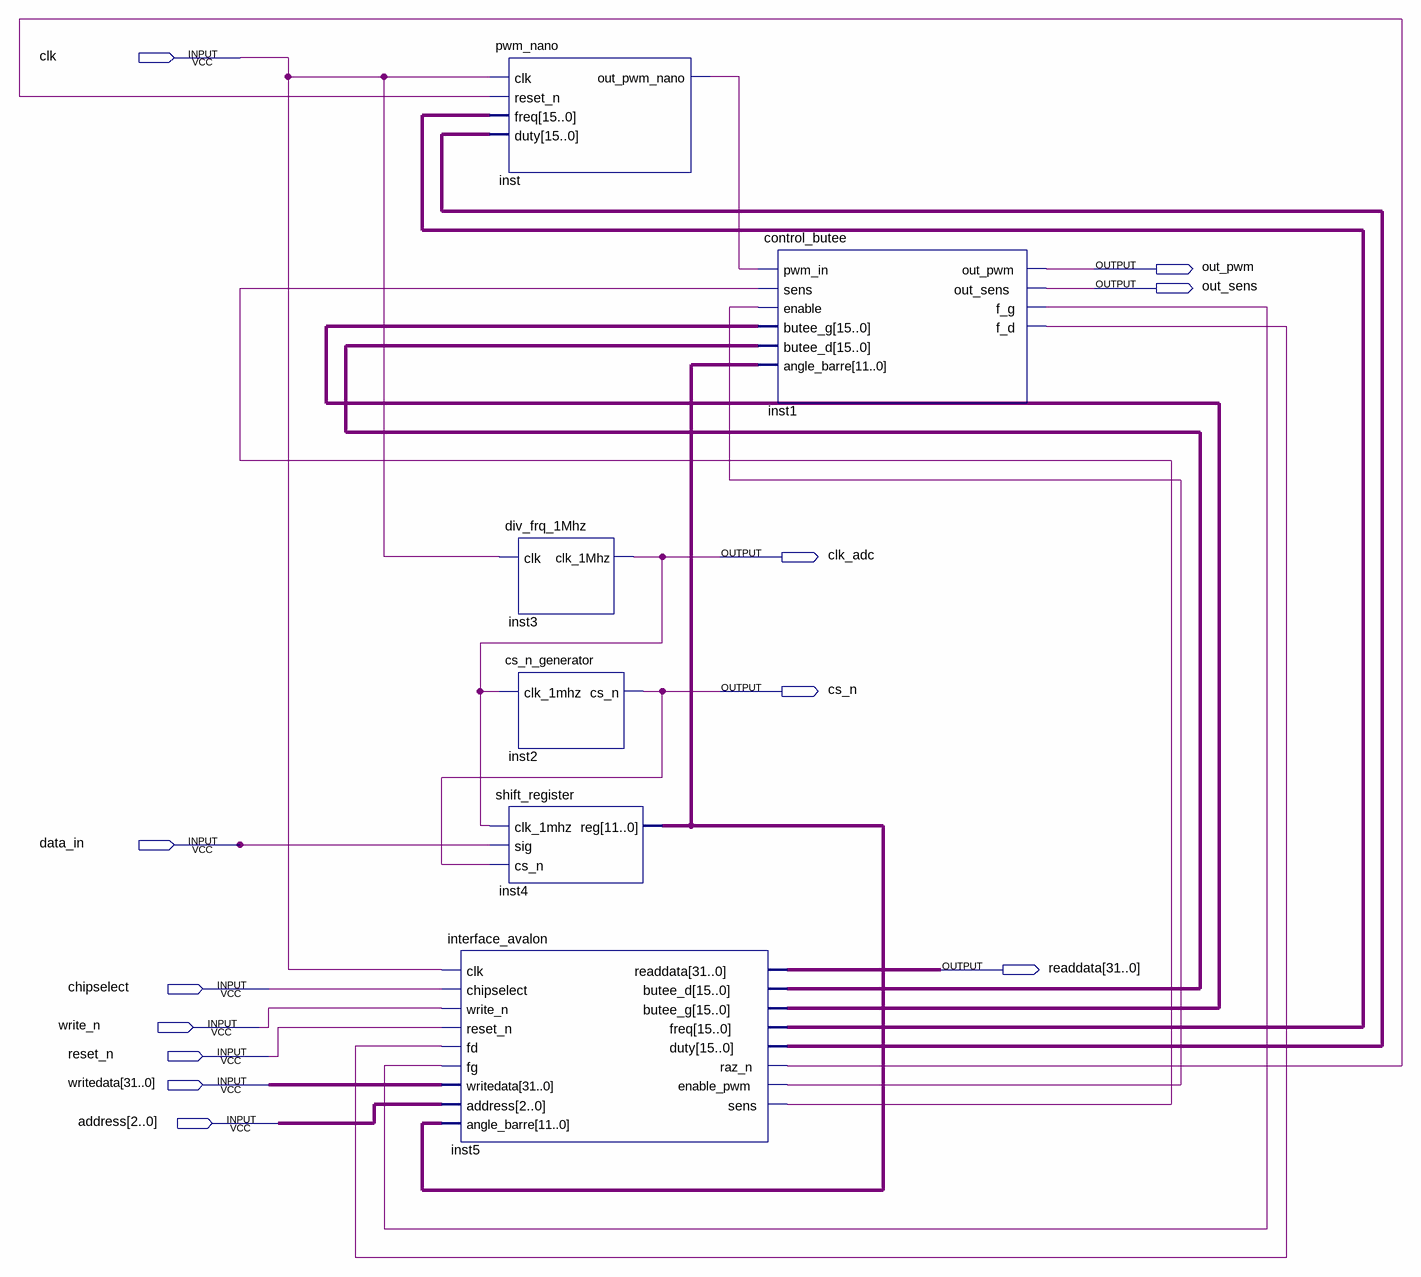
[diagram p0: schematic sheet]
// Quartus schematic verin_test.bdf as structural Verilog: 6 symbols, 12 pins
module verin_test (
  input  clk,
  input  data_in,
  input  chipselect,
  input  write_n,
  input  reset_n,
  input  [31:0] writedata,
  input  [2:0] address,
  output out_pwm,
  output out_sens,
  output clk_adc,
  output cs_n,
  output [31:0] readdata
);

  wire inst1_f_d, inst1_f_g, inst5_enable_pwm, inst5_raz_n, inst5_sens, inst_out_pwm_nano;
  wire [11:0] inst4_reg;
  wire [15:0] inst5_butee_d, inst5_butee_g, inst5_duty, inst5_freq;

  pwm_nano inst (
    .clk(clk), .reset_n(inst5_raz_n), .freq(inst5_freq), .duty(inst5_duty), .out_pwm_nano(inst_out_pwm_nano));
  shift_register inst4 (.clk_1mhz(clk_adc), .sig(data_in), .cs_n(cs_n), .\reg (inst4_reg));
  interface_avalon inst5 (
    .clk(clk), .chipselect(chipselect), .write_n(write_n), .reset_n(reset_n), .fd(inst1_f_d), .fg(inst1_f_g),
    .writedata(writedata), .address(address), .angle_barre(inst4_reg), .readdata(readdata),
    .butee_d(inst5_butee_d), .butee_g(inst5_butee_g), .freq(inst5_freq), .duty(inst5_duty),
    .raz_n(inst5_raz_n), .enable_pwm(inst5_enable_pwm), .sens(inst5_sens));
  div_frq_1Mhz inst3 (.clk(clk), .clk_1Mhz(clk_adc));
  cs_n_generator inst2 (.clk_1mhz(clk_adc), .cs_n(cs_n));
  control_butee inst1 (
    .pwm_in(inst_out_pwm_nano), .sens(inst5_sens), .enable(inst5_enable_pwm), .butee_g(inst5_butee_g),
    .butee_d(inst5_butee_d), .angle_barre(inst4_reg), .out_pwm(out_pwm), .out_sens(out_sens),
    .f_g(inst1_f_g), .f_d(inst1_f_d));
endmodule
